# Altium schematic sheet 00_TOP.SchDoc
size OrCAD B
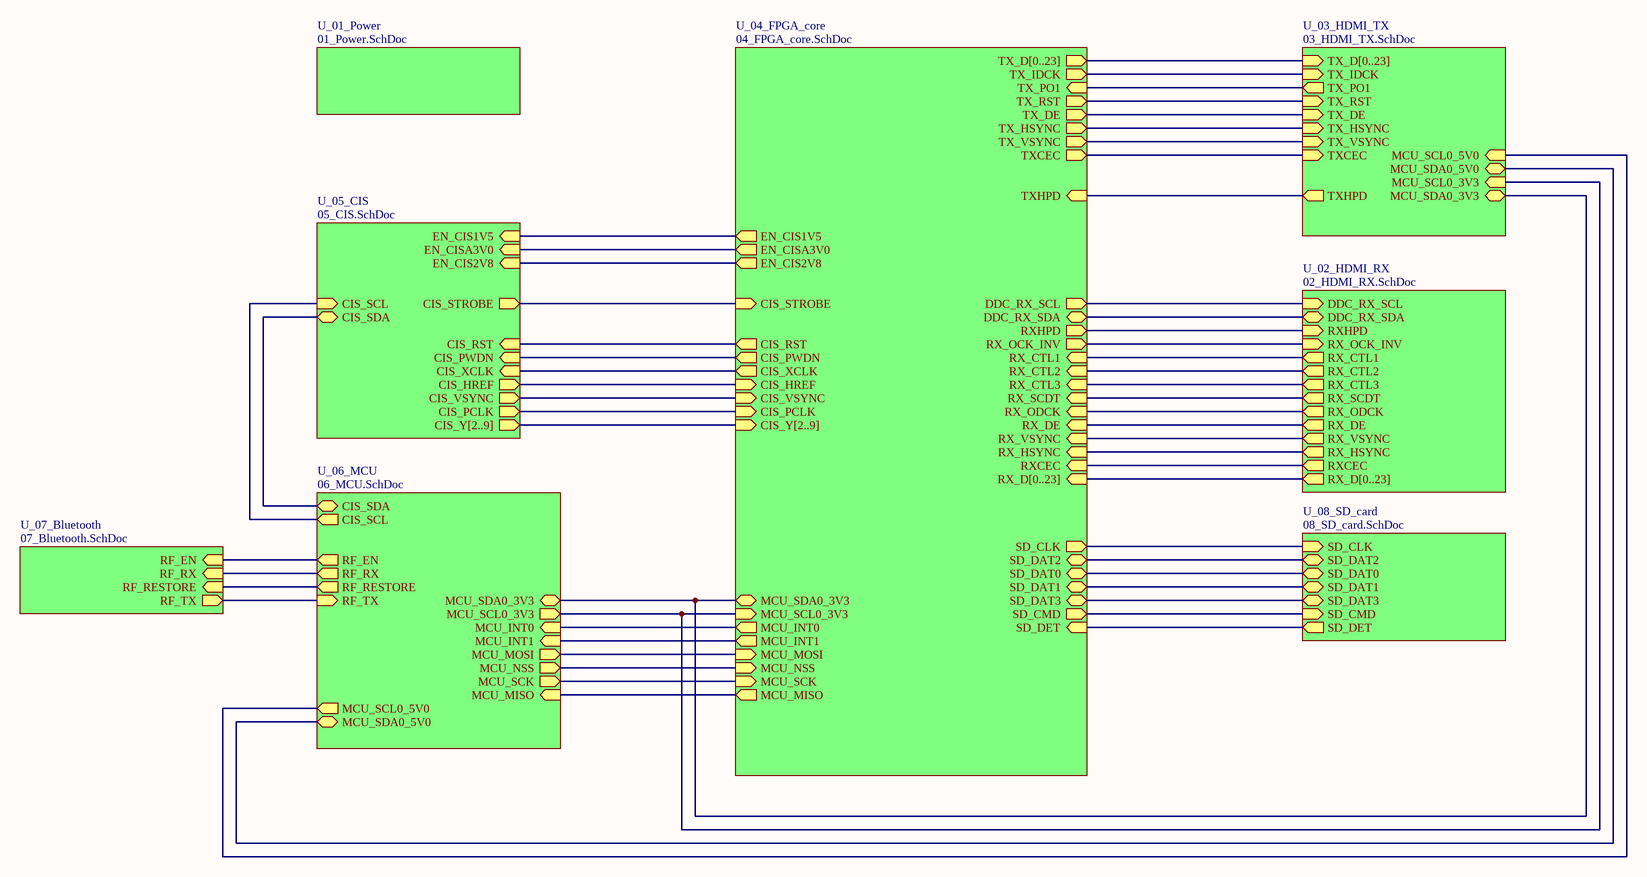
[diagram p0: 00_TOP.SchDoc]

## Sub-sheets
U_01_Power = 01_Power.SchDoc: no entries
U_02_HDMI_RX = 02_HDMI_RX.SchDoc: RXCEC (out), RXHPD (in), RX_ODCK (out), RX_CTL1 (out), RX_CTL2 (out), RX_CTL3 (out), RX_DE (out), RX_VSYNC (out), RX_HSYNC (out), RX_OCK_INV (in), RX_SCDT (out), RX_D[0..23] (out), DDC_RX_SCL (in), DDC_RX_SDA (bidir)
U_03_HDMI_TX = 03_HDMI_TX.SchDoc: TXCEC (in), TXHPD (out), TX_D[0..23] (in), TX_IDCK (in), TX_RST (in), TX_PO1 (out), TX_DE (in), TX_HSYNC (in), TX_VSYNC (in), MCU_SCL0_3V3 (in), MCU_SDA0_3V3 (bidir), MCU_SCL0_5V0 (in), MCU_SDA0_5V0 (bidir)
U_04_FPGA_core = 04_FPGA_core.SchDoc: EN_CIS1V5 (out), EN_CISA3V0 (out), EN_CIS2V8 (out), CIS_Y[2..9] (in), CIS_STROBE (in), CIS_RST (out), CIS_VSYNC (in), CIS_PWDN (out), CIS_HREF (in), TX_D[0..23] (out), TX_IDCK (out), TX_RST (out), TX_PO1 (in), TX_DE (out), TX_HSYNC (out), TX_VSYNC (out), TXCEC (out), TXHPD (in), RX_D[0..23] (in), RX_OCK_INV (out), RX_SCDT (in), RX_ODCK (in), RX_CTL1 (in), RX_CTL2 (in), RX_CTL3 (in), RX_DE (in), RX_VSYNC (in), RX_HSYNC (in), RXCEC (in), RXHPD (out), CIS_XCLK (out), CIS_PCLK (in), SD_CLK (out), SD_DAT2 (bidir), SD_DAT0 (bidir), SD_DAT1 (bidir), SD_DAT3 (bidir), SD_CMD (out), SD_DET (in), MCU_SDA0_3V3 (bidir), MCU_SCL0_3V3 (in), MCU_INT0 (out), MCU_INT1 (out), MCU_MOSI (in), MCU_NSS (in), MCU_SCK (in), MCU_MISO (out), DDC_RX_SCL (out), DDC_RX_SDA (bidir)
U_05_CIS = 05_CIS.SchDoc: CIS_XCLK (in), CIS_PCLK (out), CIS_STROBE (out), CIS_SDA (bidir), CIS_SCL (in), CIS_RST (in), CIS_VSYNC (out), CIS_PWDN (in), CIS_HREF (out), CIS_Y[2..9] (out), EN_CIS1V5 (in), EN_CISA3V0 (in), EN_CIS2V8 (in)
U_06_MCU = 06_MCU.SchDoc: RF_EN (out), RF_RX (out), RF_TX (in), RF_RESTORE (out), MCU_INT0 (in), MCU_INT1 (in), CIS_SDA (bidir), CIS_SCL (out), MCU_SDA0_5V0 (bidir), MCU_SDA0_3V3 (bidir), MCU_SCL0_3V3 (out), MCU_MOSI (out), MCU_NSS (out), MCU_SCK (out), MCU_MISO (in), MCU_SCL0_5V0 (out)
U_07_Bluetooth = 07_Bluetooth.SchDoc: RF_EN (in), RF_RX (in), RF_TX (out), RF_RESTORE (in)
U_08_SD_card = 08_SD_card.SchDoc: SD_CLK (in), SD_DAT2 (bidir), SD_DAT0 (bidir), SD_DAT1 (bidir), SD_DAT3 (bidir), SD_CMD (in), SD_DET (out)

## Nets
(unnamed): sheet U_04_FPGA_core/EN_CIS1V5, sheet U_05_CIS/EN_CIS1V5
(unnamed): sheet U_04_FPGA_core/EN_CISA3V0, sheet U_05_CIS/EN_CISA3V0
(unnamed): sheet U_04_FPGA_core/EN_CIS2V8, sheet U_05_CIS/EN_CIS2V8
(unnamed): sheet U_04_FPGA_core/CIS_STROBE, sheet U_05_CIS/CIS_STROBE
(unnamed): sheet U_04_FPGA_core/CIS_RST, sheet U_05_CIS/CIS_RST
(unnamed): sheet U_04_FPGA_core/CIS_VSYNC, sheet U_05_CIS/CIS_VSYNC
(unnamed): sheet U_04_FPGA_core/CIS_PWDN, sheet U_05_CIS/CIS_PWDN
(unnamed): sheet U_04_FPGA_core/CIS_HREF, sheet U_05_CIS/CIS_HREF
(unnamed): sheet U_04_FPGA_core/TX_IDCK, sheet U_03_HDMI_TX/TX_IDCK
(unnamed): sheet U_04_FPGA_core/TX_RST, sheet U_03_HDMI_TX/TX_RST
(unnamed): sheet U_04_FPGA_core/TX_PO1, sheet U_03_HDMI_TX/TX_PO1
(unnamed): sheet U_04_FPGA_core/TX_DE, sheet U_03_HDMI_TX/TX_DE
(unnamed): sheet U_04_FPGA_core/TX_HSYNC, sheet U_03_HDMI_TX/TX_HSYNC
(unnamed): sheet U_04_FPGA_core/TX_VSYNC, sheet U_03_HDMI_TX/TX_VSYNC
(unnamed): sheet U_04_FPGA_core/TXCEC, sheet U_03_HDMI_TX/TXCEC
(unnamed): sheet U_04_FPGA_core/TXHPD, sheet U_03_HDMI_TX/TXHPD
(unnamed): sheet U_04_FPGA_core/RX_OCK_INV, sheet U_02_HDMI_RX/RX_OCK_INV
(unnamed): sheet U_04_FPGA_core/RX_SCDT, sheet U_02_HDMI_RX/RX_SCDT
(unnamed): sheet U_04_FPGA_core/RX_ODCK, sheet U_02_HDMI_RX/RX_ODCK
(unnamed): sheet U_04_FPGA_core/RX_CTL1, sheet U_02_HDMI_RX/RX_CTL1
(unnamed): sheet U_04_FPGA_core/RX_CTL2, sheet U_02_HDMI_RX/RX_CTL2
(unnamed): sheet U_04_FPGA_core/RX_CTL3, sheet U_02_HDMI_RX/RX_CTL3
(unnamed): sheet U_04_FPGA_core/RX_DE, sheet U_02_HDMI_RX/RX_DE
(unnamed): sheet U_04_FPGA_core/RX_VSYNC, sheet U_02_HDMI_RX/RX_VSYNC
(unnamed): sheet U_04_FPGA_core/RX_HSYNC, sheet U_02_HDMI_RX/RX_HSYNC
(unnamed): sheet U_04_FPGA_core/RXCEC, sheet U_02_HDMI_RX/RXCEC
(unnamed): sheet U_04_FPGA_core/RXHPD, sheet U_02_HDMI_RX/RXHPD
(unnamed): sheet U_04_FPGA_core/CIS_XCLK, sheet U_05_CIS/CIS_XCLK
(unnamed): sheet U_04_FPGA_core/CIS_PCLK, sheet U_05_CIS/CIS_PCLK
(unnamed): sheet U_04_FPGA_core/SD_CLK, sheet U_08_SD_card/SD_CLK
(unnamed): sheet U_04_FPGA_core/SD_DAT2, sheet U_08_SD_card/SD_DAT2
(unnamed): sheet U_04_FPGA_core/SD_DAT0, sheet U_08_SD_card/SD_DAT0
(unnamed): sheet U_04_FPGA_core/SD_DAT1, sheet U_08_SD_card/SD_DAT1
(unnamed): sheet U_04_FPGA_core/SD_DAT3, sheet U_08_SD_card/SD_DAT3
(unnamed): sheet U_04_FPGA_core/SD_CMD, sheet U_08_SD_card/SD_CMD
(unnamed): sheet U_04_FPGA_core/SD_DET, sheet U_08_SD_card/SD_DET
(unnamed): sheet U_04_FPGA_core/MCU_SDA0_3V3, sheet U_03_HDMI_TX/MCU_SDA0_3V3, sheet U_06_MCU/MCU_SDA0_3V3
(unnamed): sheet U_04_FPGA_core/MCU_SCL0_3V3, sheet U_03_HDMI_TX/MCU_SCL0_3V3, sheet U_06_MCU/MCU_SCL0_3V3
(unnamed): sheet U_04_FPGA_core/MCU_INT0, sheet U_06_MCU/MCU_INT0
(unnamed): sheet U_04_FPGA_core/MCU_INT1, sheet U_06_MCU/MCU_INT1
(unnamed): sheet U_04_FPGA_core/MCU_MOSI, sheet U_06_MCU/MCU_MOSI
(unnamed): sheet U_04_FPGA_core/MCU_NSS, sheet U_06_MCU/MCU_NSS
(unnamed): sheet U_04_FPGA_core/MCU_SCK, sheet U_06_MCU/MCU_SCK
(unnamed): sheet U_04_FPGA_core/MCU_MISO, sheet U_06_MCU/MCU_MISO
(unnamed): sheet U_04_FPGA_core/DDC_RX_SCL, sheet U_02_HDMI_RX/DDC_RX_SCL
(unnamed): sheet U_04_FPGA_core/DDC_RX_SDA, sheet U_02_HDMI_RX/DDC_RX_SDA
(unnamed): sheet U_03_HDMI_TX/MCU_SCL0_5V0, sheet U_06_MCU/MCU_SCL0_5V0
(unnamed): sheet U_03_HDMI_TX/MCU_SDA0_5V0, sheet U_06_MCU/MCU_SDA0_5V0
(unnamed): sheet U_05_CIS/CIS_SDA, sheet U_06_MCU/CIS_SDA
(unnamed): sheet U_05_CIS/CIS_SCL, sheet U_06_MCU/CIS_SCL
(unnamed): sheet U_06_MCU/RF_EN, sheet U_07_Bluetooth/RF_EN
(unnamed): sheet U_06_MCU/RF_RX, sheet U_07_Bluetooth/RF_RX
(unnamed): sheet U_06_MCU/RF_TX, sheet U_07_Bluetooth/RF_TX
(unnamed): sheet U_06_MCU/RF_RESTORE, sheet U_07_Bluetooth/RF_RESTORE

## Buses and harness runs
bus sheet U_02_HDMI_RX/RX_D[0..23] = sheet U_04_FPGA_core/RX_D[0..23]
bus sheet U_03_HDMI_TX/TX_D[0..23] = sheet U_04_FPGA_core/TX_D[0..23]
bus sheet U_04_FPGA_core/CIS_Y[2..9] = sheet U_05_CIS/CIS_Y[2..9]